# Altium schematic sheet SH12 - RS-485.SchDoc: Power Distribution Board Rev2 - RS-485
size Letter; DrawnBy: Cindy Li; Organization: UW Robotics; Address1: 200 University Avenue; Address2: Waterloo; Address3: Ontario; Address4: Canada N2L 3G6; DocumentNumber: 12; SheetNumber: 12; SheetTotal: 12
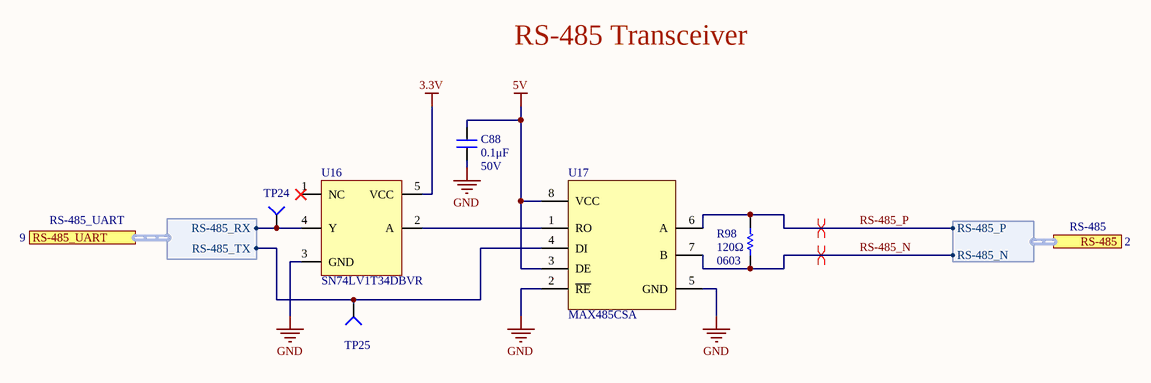
[diagram p0: SH12 - RS-485.SchDoc]

## Parts
C88  value 0.1μF  Voltage Rating: 50V  [CAP0603]  (hidden comment: CAP_0.1uF_50V_0603)
R98  value 120Ω  Case Code (Imperial): 0603  [RESC0603(1608)_N]  (hidden comment: RES_120Ω_0603)
TP24  TESTPOINT_SMD_LOOP  [S1751-46R]  (value not drawn)
TP25  TESTPOINT_SMD_LOOP  [S1751-46R]  (value not drawn)
U16  SN74LV1T34  [SN74LV1T34DBVR]  (value not drawn)
U17  MAX485CSA  [SOIC127P600X175-8N]

## Ports
RS-485 (harness RS-485, see 2), RS-485_UART (harness RS-485_UART, see 9)

## Harnesses
RS-485: RS-485_N, RS-485_P
RS-485_UART: RS-485_RX, RS-485_TX

## Nets
3.3V: U16.5(VCC)
5V: C88.1 U17.3(DE) U17.8(VCC)
GND: C88.2 U16.3(GND) U17.2(~{RE}) U17.5(GND)
RS-485_N: R98.1 U17.7(B) ; port RS-485.RS-485_N
RS-485_P: R98.2 U17.6(A) ; port RS-485.RS-485_P
NetTP24_1: TP24.1(=value) U16.4(Y) ; port RS-485_UART.RS-485_RX
NetTP25_1: TP25.1(=value) U17.4(DI) ; port RS-485_UART.RS-485_TX
NetU16_2: U16.2(A) U17.1(RO)

Not connected (* = marked no-connect by the designer): U16 1(NC)*

## Layout directives
differential pair: RS-485_N, RS-485_P

## Notes on the sheet
- RS-485 Transceiver
- Title
- Size:
- Date:
- Letter
- Drawn By:
- Sheet
- of
- File:

## Library data of the parts
C88 = CAP_0.1uF_50V_0603: CAP CER 0.1UF 50V X7R 0603; Manufacturer Part Number 1: CC0603KRX7R9BB104; Manufacturer 1: Yageo; Dimensions: 0.063" L x 0.031" W (1.60mm x 0.80mm); Package: 0603 (1608 Metric); Temperature Coefficient: X7R; Supplier Part Number 1: 311-1344-1-ND; Supplier 1: Digi-Key; Mount: Surface Mount; Case Code (Imperial): 0603; Case Code (Metric): 1608; Dielectric: X7R
R98 = RES_120Ω_0603_5%: RES 120 OHM 5% 1/10W 0603; Manufacturer 1: Yageo; Manufacturer Part Number 1: RC0603JR-07120RL; Package: 0603 (1608 Metric); Dimensions: 0.063" L x 0.031" W (1.60mm x 0.80mm); Tolerance: 5%; Supplier Part Number 1: 311-120GRCT-ND; Supplier 1: Digi-Key; Mount: Surface Mount; Case Code (Metric): 1608
TP24 TP25 = TESTPOINT_SMD_LOOP: PC TEST POINT SMD; Manufacturer 1: Harwin; Plating: Tin; Number of Ports: 1; Supplier 1: Digi-Key; Manufacturer Part Number 1: S1751-46R; RoHS: Yes; Category: Terminal Blocks; Stock 1: 159143; Pricing 1: 1=0.29000, 10=0.27700, 25=0.23760, 50=0.20200, 100=0.19400, 250=0.17424, 500=0.16632, 1000=0.13860 (USD); Mount: Surface Mount; Material: Brass,Copper Alloy; Contact Material: Copper,Copper Alloy; Contact Plating: Tin; Color: Natural; Termination: Solder; Orientation: Straight; Number of Contacts: 1; Package Quantity: 2500; Packaging: Tape and Reel; Length: 3.25mm; Height: 2mm; Depth: 2mm; Width: 1.65mm; Radiation Hardening: No; REACH SVHC: No SVHC; ComponentLink1URL: https://datasheet.ciiva.com:443/pdfs/VipMasterIC/IC/HRWN/HRWN-S-A0002541722/HRWN-S-A0004513972-1.pdf?src-supplier=IHS+Markit; ComponentLink1Description: https://datasheet.ciiva.com:443/pdfs/VipMasterIC/IC/HRWN/HRWN-S-A0002541722/HRWN-S-A0004513972-1.pdf?src-supplier=IHS+Markit; ComponentLink2URL: https://datasheet.ciiva.com/5224/2010page161-58228-5224784.pdf?src-supplier=Mouser; ComponentLink2Description: https://datasheet.ciiva.com/5224/2010page161-58228-5224784.pdf?src-supplier=Mouser; ComponentLink3URL: https://datasheet.ciiva.com/22631/1688119-22631153.pdf?src-supplier=Element14; ComponentLink3Description: https://datasheet.ciiva.com/22631/1688119-22631153.pdf?src-supplier=Element14; ComponentLink4URL: https://datasheet.ciiva.com/2917/s1751-2917604.pdf?src-supplier=Digi-Key; ComponentLink4Description: https://datasheet.ciiva.com/2917/s1751-2917604.pdf?src-supplier=Digi-Key; ComponentLink5URL: https://datasheet.ciiva.com/1462/1693781-1462652.pdf?src-supplier=Farnell; ComponentLink5Description: https://datasheet.ciiva.com/1462/1693781-1462652.pdf?src-supplier=Farnell; ComponentLink6URL: https://datasheet.ciiva.com/1454/1693781-1454941.pdf?src-supplier=Element14; ComponentLink6Description: https://datasheet.ciiva.com/1454/1693781-1454941.pdf?src-supplier=Element14; Supplier Part Number 1: 952-1478-1-ND
U16 = SN74LV1T34: Bus Driver, LV/LV-A/LVX/H Series, 1-Func, 1-Bit, True Output, CMOS, PDSO5; Manufacturer 1: Texas Instruments; Package Body Material: Plastic; Load Capacitance (CL): 30pF; Max I(ol): 8mA; Number of Bits: 1; Number of Ports: 2; Package Equivalence Code: TSOP5/6,.11,37; Power Supplies: 3.3V; Prop. Delay@Nom-Sup: 9ns; Propagation Delay (tpd): 14.5ns; Schmitt Trigger: No; Supply Voltage-Max (Vsup): 5.5V; Supply Voltage-Min (Vsup): 1.6V; Supply Voltage-Nom (Vsup): 1.8V; Qualification Status: Not Qualified; Supplier 1: Digi-Key; RoHS: Yes; Category: Buffers, Drivers and Transceivers; Stock 1: 38219; Pricing 1: 1=0.41000, 10=0.32900, 25=0.30120, 100=0.22400, 250=0.20300, 500=0.16800, 1000=0.12600 (USD); Package Code: LSSOP; Number of Pins: 5; Terminal Finish: Nickel; Package Shape: Rectangular; Min Operating Temperature: -40°C; Max Operating Temperature: 125°C; Logic IC Type: BUS DRIVER; Moisture Sensitivity Level: 1; JESD-609 Code: e4; Number of Functions: 1; Package Style: SMALL OUTLINE, LOW PROFILE, SHRINK PITCHMeter; Packaging: Tape and Reel; Peak Reflow Temperature (Cel): 260°C; Surface Mount: Yes; Technology: CMOS; Terminal Form: Gull Wing; Terminal Position: DUAL; Output Polarity: True; JESD-30 Code: R-PDSO-G5; Length: 2.9mm; Width: 1.6mm; Height - Seated (Max): 1.45mm; Terminal Pitch: 0.95mm; Temperature Grade: AUTOMOTIVE; ComponentLink1URL: https://www.ti.com:443/lit/ds/symlink/sn74lv1t34.pdf?src-supplier=IHS+Markit; ComponentLink1Description: https://www.ti.com:443/lit/ds/symlink/sn74lv1t34.pdf?src-supplier=IHS+Markit; ComponentLink2URL: https://datasheet.ciiva.com/29634/sn74lv1t34-29634758.pdf?src-supplier=Digi-Key; ComponentLink2Description: https://datasheet.ciiva.com/29634/sn74lv1t34-29634758.pdf?src-supplier=Digi-Key; ComponentLink3URL: https://datasheet.ciiva.com/29634/sn74lv1t34-29634759.pdf?src-supplier=Digi-Key; ComponentLink3Description: https://datasheet.ciiva.com/29634/sn74lv1t34-29634759.pdf?src-supplier=Digi-Key; ComponentLink4URL: https://datasheet.ciiva.com/29634/sn74lv1t34-29634760.pdf?src-supplier=Digi-Key; ComponentLink4Description: https://datasheet.ciiva.com/29634/sn74lv1t34-29634760.pdf?src-supplier=Digi-Key; ComponentLink5URL: https://datasheet.ciiva.com/29888/sn74lv1t34-29888041.pdf?src-supplier=Avnet; ComponentLink5Description: https://datasheet.ciiva.com/29888/sn74lv1t34-29888041.pdf?src-supplier=Avnet; Supplier Part Number 1: 296-37176-1-ND; Manufacturer Part Number 1: SN74LV1T34DBVR
U17 = MAX485CSA: 1/1 Transceiver Half RS422, RS485 8-SOIC; Manufacturer 1: Maxim Integrated; Manufacturer Part Number 1: MAX485CSA+T; Data Rate: 2.5Mbps; Supply Voltage: 4.75V - 5.25V; Supplier 1: Digi-Key; Supplier Part Number 1: MAX485CSA+TCT-ND; Protocol: RS422, RS485; Mounting Type: Surface Mount; Package / Case: 8-SOIC